# Altium schematic sheet Power-Supplies.SchDoc
size A3; Organization: Altium Limited; Address1: L3, 12a Rodborough Rd; Address2: Frenchs Forest; Address3: NSW; Address4: Australia 2086
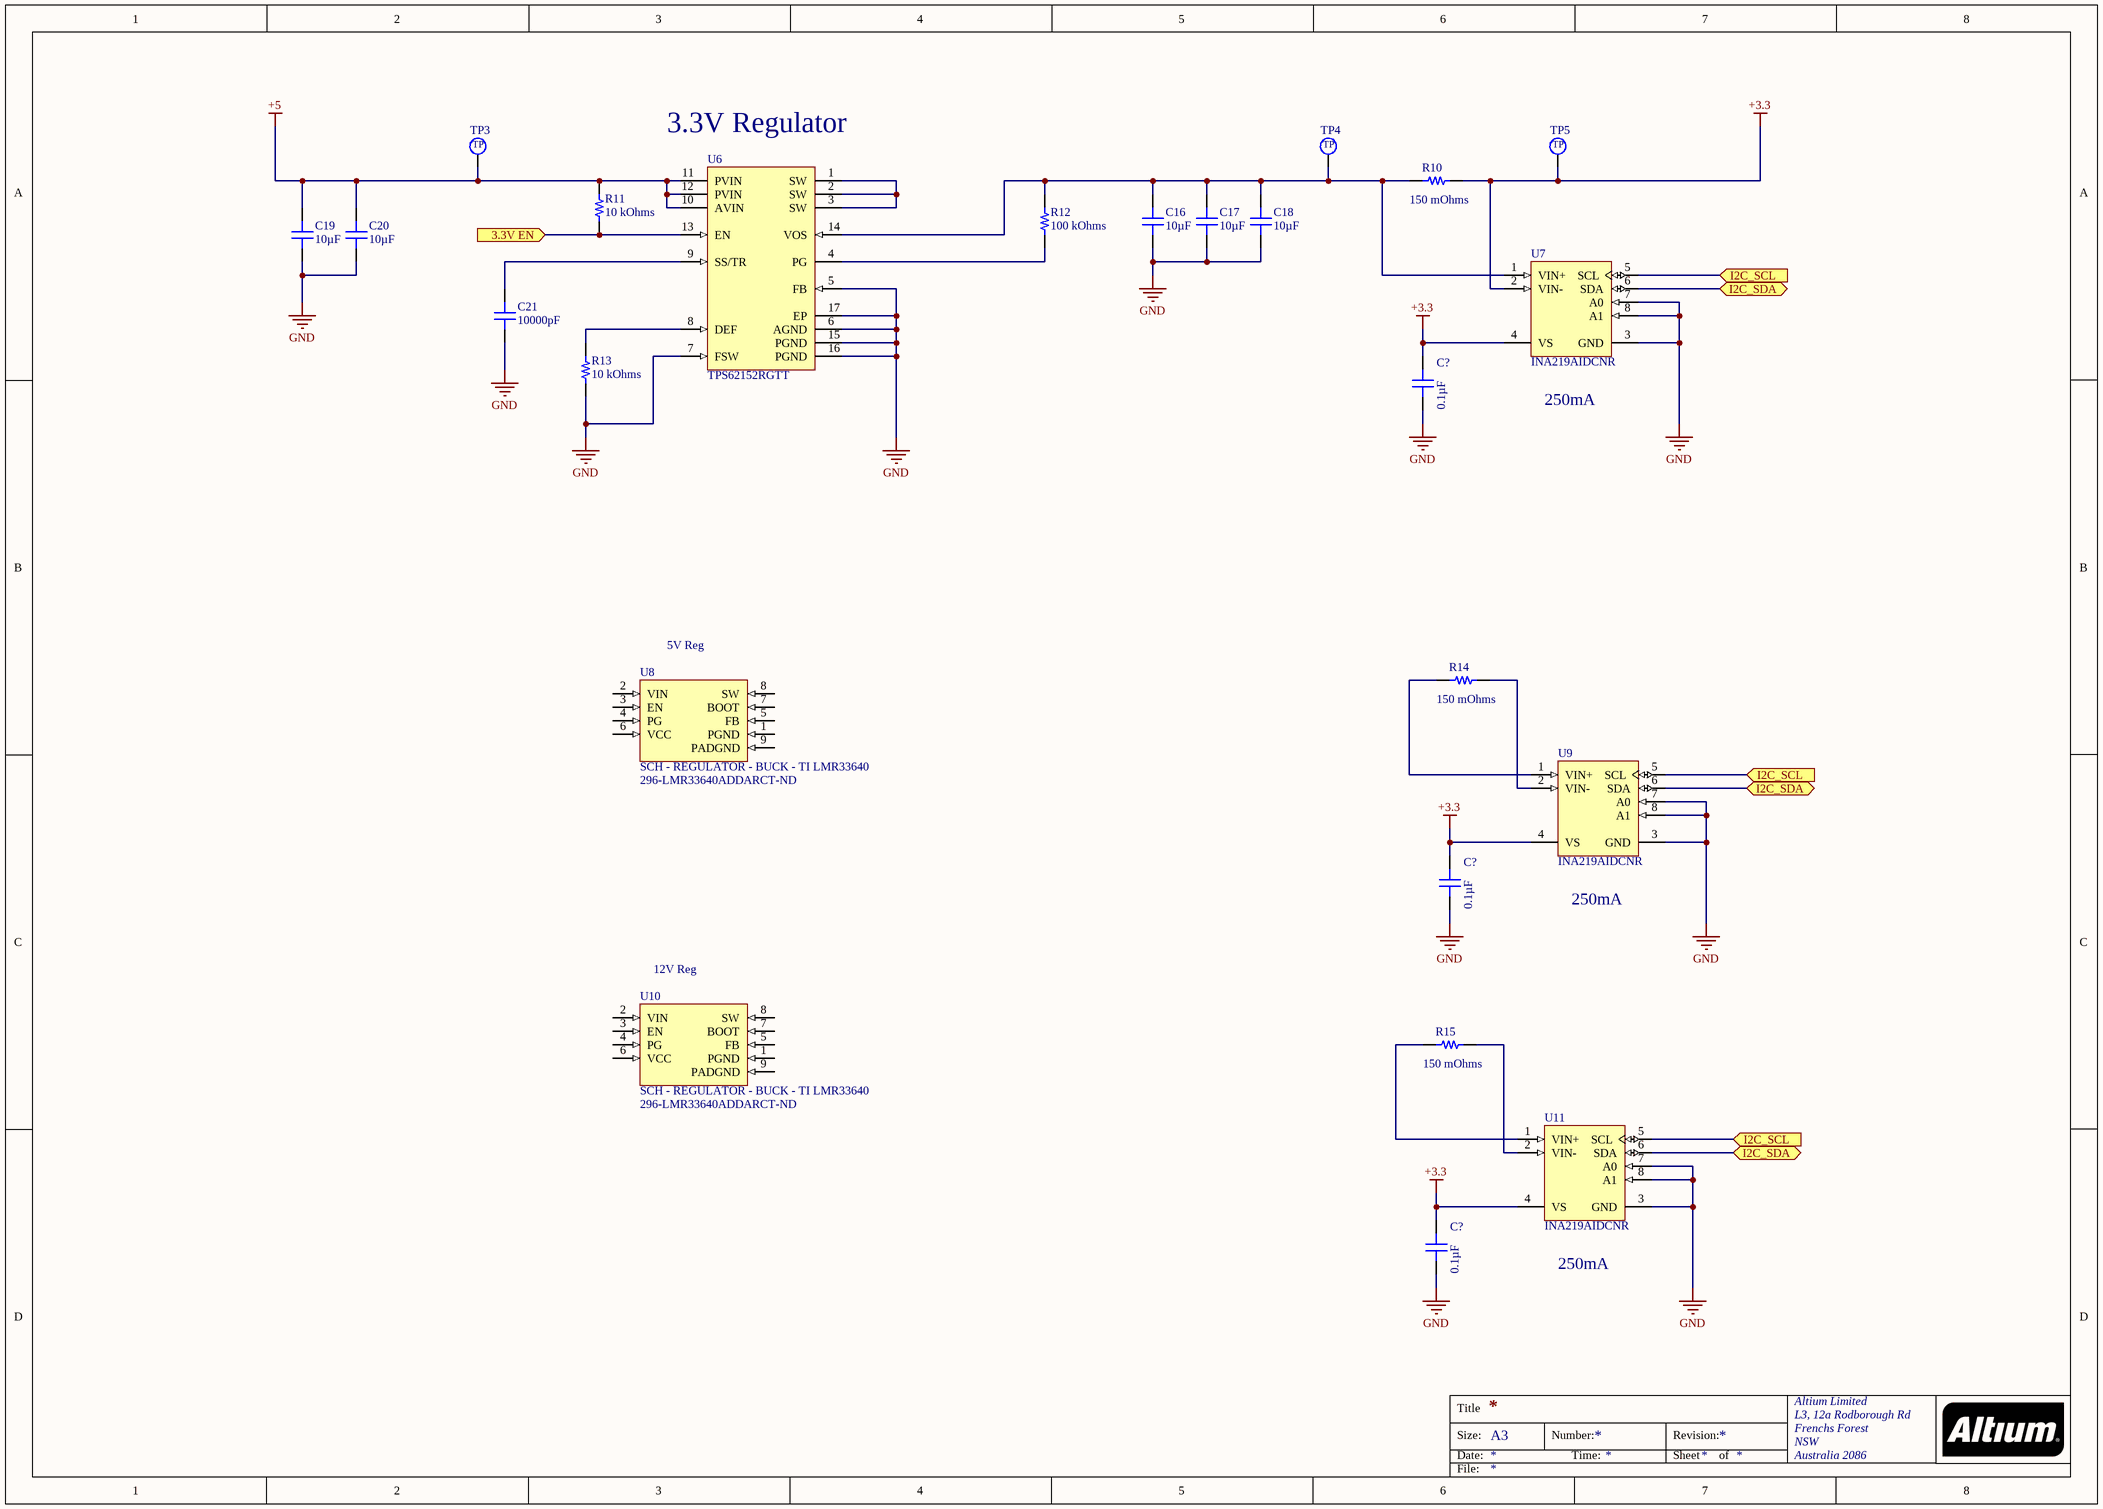
[diagram p0: Power-Supplies.SchDoc]

## Parts
(Parts that share a designator on the sheet are numbered #1, #2 ... from top to bottom, then left to right.)
C16  10µF  [CAP 0805_2012]
C17  10µF  [CAP 0805_2012]
C18  10µF  [CAP 0805_2012]
C19  10µF  [CAP 0805_2012]
C20  10µF  [CAP 0805_2012]
C21  10000pF  [CAP 0603_1608]
C?#1  0.1µF  [CAP 0603_1608]
C?#2  0.1µF  [CAP 0603_1608]
C?#3  0.1µF  [CAP 0603_1608]
R10  150 mOhms  [RES 0805_2012]
R11  10 kOhms  [RES 0603_1608]
R12  100 kOhms  [RES 0603_1608]
R13  10 kOhms  [RES 0603_1608]
R14  150 mOhms  [RES 0805_2012]
R15  150 mOhms  [RES 0805_2012]
TP3  2.5mm_SMD_TestPoint  [2.5mm TestPoint]  (value not drawn)
TP4  2.5mm_SMD_TestPoint  [2.5mm TestPoint]  (value not drawn)
TP5  2.5mm_SMD_TestPoint  [2.5mm TestPoint]  (value not drawn)
U6  TPS62152RGTT  [RGT0016C_V]
U7  INA219AIDCNR  [DCN0008A_M]
U8  SCH - REGULATOR - BUCK - TI LMR33640  Supplier Part Number 1: 296-LMR33640ADDARCT-ND  [PCB - LEADS - SOIC - TI 8-PowerSOIC]
U9  INA219AIDCNR  [DCN0008A_M]
U10  SCH - REGULATOR - BUCK - TI LMR33640  Supplier Part Number 1: 296-LMR33640ADDARCT-ND  [PCB - LEADS - SOIC - TI 8-PowerSOIC]
U11  INA219AIDCNR  [DCN0008A_M]

## Ports
3.3V EN (in), I2C_SCL (in), I2C_SDA (bidir)

## Nets
+3.3: C?#1.2 C?#2.2 C?#3.2 R10.2 TP5.1 U7.2(VIN-) U7.4(VS) U9.4(VS) U11.4(VS)
+5: C19.2 C20.2 R11.2 TP3.1 U6.10(AVIN) U6.11(PVIN) U6.12(PVIN)
GND: C16.1 C17.1 C18.1 C19.1 C20.1 C21.1 C?#1.1 C?#2.1 C?#3.1 R13.1 U6.5(FB) U6.6(AGND) U6.7(FSW) U6.15(PGND) U6.16(PGND) U6.17(EP) U7.3(GND) U7.7(A0) U7.8(A1) U9.3(GND) U9.7(A0) U9.8(A1) U11.3(GND) U11.7(A0) U11.8(A1)
3.3V EN: R11.1 U6.13(EN) ; port 3.3V EN
I2C_SCL: U7.5(SCL) U9.5(SCL) U11.5(SCL) ; port I2C_SCL
I2C_SDA: U7.6(SDA) U9.6(SDA) U11.6(SDA) ; port I2C_SDA
NetC16_2: C16.2 C17.2 C18.2 R10.1 R12.2 TP4.1 U6.14(VOS) U7.1(VIN+)
NetC21_2: C21.2 U6.9(SS/TR)
NetR12_1: R12.1 U6.4(PG)
NetR13_2: R13.2 U6.8(DEF)
NetR14_1: R14.1 U9.1(VIN+)
NetR14_2: R14.2 U9.2(VIN-)
NetR15_1: R15.1 U11.1(VIN+)
NetR15_2: R15.2 U11.2(VIN-)
NetU6_1: U6.1(SW) U6.2(SW) U6.3(SW)

Not connected (* = marked no-connect by the designer): U8 1(PGND) 2(VIN) 3(EN) 4(PG) 5(FB) 6(VCC) 7(BOOT) 8(SW) 9(PADGND); U10 1(PGND) 2(VIN) 3(EN) 4(PG) 5(FB) 6(VCC) 7(BOOT) 8(SW) 9(PADGND)

## Notes on the sheet
- (near U6) 3.3V Regulator
- (near U7) 250mA
- (near U8) 5V Reg
- (near U9) 250mA
- (near U10) 12V Reg
- (near U11) 250mA
- Title
- Size:
- Date:
- A3
- Number:
- Time:
- Revision:
- Sheet
- of
- File:
- (in symbol 2.5mm_SMD_TestPoint) TP

## Library data of the parts
C16-C20 = CC0805KKX5R7BB106: CAP CER 10UF 16V X5R 0805; Manufacturer: Yageo; Tolerance: ±10%; Part Number: CC0805KKX5R7BB106; Value: 10µF; Applications: General Purpose; Capacitance: 10µF; ComponentLink1Description: Datasheet; ComponentLink1URL: https://www.yageo.com/upload/media/product/productsearch/datasheet/mlcc/UPY-GPHC_X5R_4V-to-50V_25.pdf; ComponentLink2Description: DigiKey Link; ComponentLink2URL: http://digikey.com/product-detail/en/yageo/CC0805KKX5R7BB106/311-1865-1-ND/5195767; Device Package: 0805 (2012 Metric); LastUpdated: 9/2/2020 1:04:30 AM; Lifecycle Status: Active; Minimum Order: 1; Mounting Type: Surface Mount, MLCC; Operating Temperature: -55°C ~ 85°C; Package / Case: 0805 (2012 Metric); Packaging: TapeAndReel; PartId: 8867; Part Status: Active; Price: 0.09; Series: CC; Size / Dimension: 0.079" L x 0.049" W (2.00mm x 1.25mm); Supplier 1: DigiKey; Supplier Part Number 1: 311-1865-1-ND; Temperature Coefficient: X5R; Thickness (Max): 0.057" (1.45mm); Voltage - Rated: 16V
C21 = C0603S103K4RACTU: CAP CER 10000PF 16V X7R 0603; Manufacturer: KEMET; Tolerance: ±10%; Part Number: C0603S103K4RACTU; Value: 10000pF; Applications: Boardflex Sensitive; Capacitance: 10000pF; ComponentLink1Description: Datasheet; ComponentLink1URL: https://api.kemet.com/component-edge/download/datasheet/C0603S103K4RACTU.pdf; ComponentLink2Description: DigiKey Link; ComponentLink2URL: http://digikey.com/product-detail/en/kemet/C0603S103K4RACTU/399-9135-1-ND/3522653; Device Package: 0603 (1608 Metric); Features: Floating Electrode; LastUpdated: 9/2/2020 1:03:34 AM; Lifecycle Status: Active; Minimum Order: 1; Mounting Type: Surface Mount, MLCC; Operating Temperature: -55°C ~ 125°C; Package / Case: 0603 (1608 Metric); Packaging: TapeAndReel; PartId: 3312; Part Status: Active; Price: 0.07; Series: SMD Comm X7R FE; Size / Dimension: 0.063" L x 0.031" W (1.60mm x 0.80mm); Supplier 1: DigiKey; Supplier Part Number 1: 399-9135-1-ND; Temperature Coefficient: X7R; Thickness (Max): 0.034" (0.87mm); Voltage - Rated: 16V
C?#1-C?#3 = CL10B104KA8WPNC: CAP CER 0.1UF 25V X7R 0603; Manufacturer: Samsung Electro-Mechanics; Tolerance: ±10%; Part Number: CL10B104KA8WPNC; Value: 0.1µF; Applications: Automotive; Capacitance: 0.1µF; ComponentLink1Description: Datasheet; ComponentLink1URL: http://www.samsungsem.com/kr/support/product-search/mlcc/CL10B104KA8WPNC.jsp; ComponentLink2Description: DigiKey Link; ComponentLink2URL: http://digikey.com/product-detail/en/samsung-electro-mechanics/CL10B104KA8WPNC/1276-6717-1-ND/5961576; Device Package: 0603 (1608 Metric); Features: Open Mode; LastUpdated: 9/2/2020 1:03:30 AM; Lifecycle Status: Active; Minimum Order: 1; Mounting Type: Surface Mount, MLCC; Operating Temperature: -55°C ~ 125°C; Package / Case: 0603 (1608 Metric); Packaging: TapeAndReel; PartId: 5631; Part Status: Active; Price: 0.02; Ratings: AEC-Q200; Series: CL; Size / Dimension: 0.063" L x 0.031" W (1.60mm x 0.80mm); Supplier 1: DigiKey; Supplier Part Number 1: 1276-6717-1-ND; Temperature Coefficient: X7R; Thickness (Max): 0.035" (0.90mm); Voltage - Rated: 25V
R10 R14 R15 = KRL1220E-M-R150-F-T5: RES 0.15 OHM 1% 1/2W 0805; Manufacturer: Susumu; Power (Watts): 0.5W, 1/2W; Temperature Coefficient: ±50ppm/°C; Part Number: KRL1220E-M-R150-F-T5; Value: 150 mOhms; ComponentLink1Description: Datasheet; ComponentLink1URL: http://www.susumu.co.jp/common/pdf/n_catalog_partition09_en.pdf; ComponentLink2Description: DigiKey Link; ComponentLink2URL: http://digikey.com/product-detail/en/susumu/KRL1220E-M-R150-F-T5/408-1558-1-ND/3737740; Composition: Metal Foil; Device Package: 0805 (2012 Metric); Features: Automotive AEC-Q200, Current Sense; Height - Seated (Max): 0.028" (0.70mm); LastUpdated: 9/2/2020 1:14:36 AM; Lifecycle Status: Active; Minimum Order: 1; Number of Terminations: 2; Operating Temperature: -55°C ~ 155°C; Package / Case: 0805 (2012 Metric); Packaging: TapeAndReel; PartId: 47680; Part Status: Active; Price: 0.08; Ratings: AEC-Q200; Resistance: 150 mOhms; Series: KRL; Size / Dimension: 0.079" L x 0.049" W (2.00mm x 1.25mm); Supplier 1: DigiKey; Supplier Part Number 1: 408-1558-1-ND; Supplier Device Package: 0805; Tolerance: ±1%
R11 R13 = RMCF0603JT10K0: RES 10K OHM 5% 1/10W 0603; Manufacturer: Stackpole Electronics Inc; Power (Watts): 0.1W, 1/10W; Temperature Coefficient: ±200ppm/°C; Part Number: RMCF0603JT10K0; Value: 10 kOhms; ComponentLink1Description: Datasheet; ComponentLink1URL: https://www.seielect.com/catalog/sei-packaging.pdf; ComponentLink2Description: DigiKey Link; ComponentLink2URL: http://digikey.com/product-detail/en/stackpole-electronics-inc/RMCF0603JT10K0/RMCF0603JT10K0CT-ND/1943191; Composition: Thick Film; Device Package: 0603 (1608 Metric); Features: Automotive AEC-Q200; Height - Seated (Max): 0.022" (0.55mm); LastUpdated: 8/30/2020 8:48:45 PM; Lifecycle Status: Active; Minimum Order: 1; Number of Terminations: 2; Operating Temperature: -55°C ~ 155°C; Package / Case: 0603 (1608 Metric); Packaging: CutTape; PartId: 25659; Part Status: Active; Price: 0.10; Ratings: AEC-Q200; Resistance: 10 kOhms; Series: RMCF; Size / Dimension: 0.061" L x 0.031" W (1.55mm x 0.80mm); Supplier 1: DigiKey; Supplier Part Number 1: RMCF0603JT10K0CT-ND; Supplier Device Package: 0603; Tolerance: ±5%
R12 = RC0603JR-10100KL: RES SMD 100K OHM 5% 1/10W 0603; Manufacturer: Yageo; Power (Watts): 0.1W, 1/10W; Temperature Coefficient: ±100ppm/°C; Part Number: RC0603JR-10100KL; Value: 100 kOhms; ComponentLink1Description: Datasheet; ComponentLink1URL: https://www.yageo.com/upload/media/product/productsearch/datasheet/rchip/PYu-RC_Group_51_RoHS_L_10.pdf; ComponentLink2Description: DigiKey Link; ComponentLink2URL: http://digikey.com/product-detail/en/yageo/RC0603JR-10100KL/YAG2294CT-ND/5252408; Composition: Thick Film; Device Package: 0603 (1608 Metric); Features: Moisture Resistant; Height - Seated (Max): 0.022" (0.55mm); LastUpdated: 9/2/2020 1:10:22 AM; Lifecycle Status: Active; Minimum Order: 1; Number of Terminations: 2; Operating Temperature: -55°C ~ 155°C; Package / Case: 0603 (1608 Metric); Packaging: CutTape; PartId: 6071; Part Status: Active; Price: 0.10; Resistance: 100 kOhms; Series: RC; Size / Dimension: 0.063" L x 0.031" W (1.60mm x 0.80mm); Supplier 1: DigiKey; Supplier Part Number 1: YAG2294CT-ND; Supplier Device Package: 0603; Tolerance: ±5%
U6 = CMP-0323-00129-3: Buck Step Down Regulator with 3 to 17 V Input and 3.3 V Output, -40 to 85 degC, 16-Pin QFN (RGT), Green (RoHS & no Sb/Br); Manufacturer: Texas Instruments; Rating: Catalog; Duty Cycle(Max)(%): 100; Regulated Outputs(#): 1; Preset Vout(V): 3.3; Vin(Max)(V): 17; Switch Current Limit(Typ)(A): 1.7; SubFamily: Step-Down Regulator; Iq(Typ)(mA): 0.017; Vin(Min)(V): 3; Synchronous Rectification: TRUE; PackageVersion: revH, Oct-2011; ComponentLink2Description: Package Specification; Code_JEDEC: MO-220; ComponentLink1Description: Datasheet; PackageDescription: 16-Pin Plastic Quad Flat No-Lead, 3 x 3 mm Body, 0.5 mm Pitch, 1.7 x 1.7 mm Exposed Pad; Iout(Max)(A): 1; Eco-Plan: Green (RoHS & no Sb/Br); PartNumber: TPS62152RGTT; Vout(Max)(V): 3.3; Topology: Buck; ComponentLink3URL: Samples URL:http://www.ti.com/product/tps54611#samples; ComponentLink2URL: http://www.ti.com/litv/pdf/mpqf119g; ComponentLink3Description: URL Link1; ComponentLink1URL: http://www.ti.com/general/docs/lit/getliterature.tsp?genericPartNumber=TPS62152&fileType=pdf; Vout(Min)(V): 3.3; Mounting Technology: Surface Mount; DatasheetVersion: SLVSAL5; PackageReference: RGT0016C
U7 U9 U11 = CMP-0704-00041-2: Zero-Drift, Bi-directional Current / Power Monitor, 3 to 5.5 V, -40 to 125 degC, 8-pin SOP (DCN8), Green (RoHS & no Sb/Br); Manufacturer: Texas Instruments; Input Offset (+/-)(Max)(uV): 100; Small-Signal Bandwidth(Typ)(MHz): 0.011; SubFamily: Current Shunt Monitor; Rating: Catalog; Quiescent Current (+/-)(Typ)(mA): 0.7; Vs(Max)(V): 5.5; Common Mode Range(Min)(V): 0; Vs(Min)(V): 3; Common Mode Range(Max)(V): 26; Gain(V/V): 1, 0.5, 0.25, 0.125; ComponentLink3URL: http://www.ti.com/lit/ml/mpds099c/mpds099c.pdf; ComponentLink2URL: http://www.ti.com/general/docs/lit/getliterature.tsp?genericPartNumber=INA219&fileType=pdf; PackageReference: DCN0008A; ComponentLink1URL: http://www.ti.com/; ComponentLink1Description: Manufacturer URL; Code_JEDEC: MO-178; CMRR(Min)(dB): 100; DatasheetVersion: SBOS448F; Mounting Technology: Surface Mount; ComponentLink3Description: Package Specification; PartNumber: INA219AIDCNR; PackageVersion: 4202106/D, 11/2009; Eco-Plan: Green (RoHS & no Sb/Br); ComponentLink2Description: Datasheet; PackageDescription: 8-Pin Plastic Small Outline, Body 1.6 x 2.9 mm, Pitch 0.65 mm
U8 U10 = SCH - REGULATOR - BUCK - TI LMR33640: Supplier 1: Digi-Key